# Altium schematic sheet 0.66寸oled.SchDoc
size A4; SheetNumber: 1; SheetTotal: 1
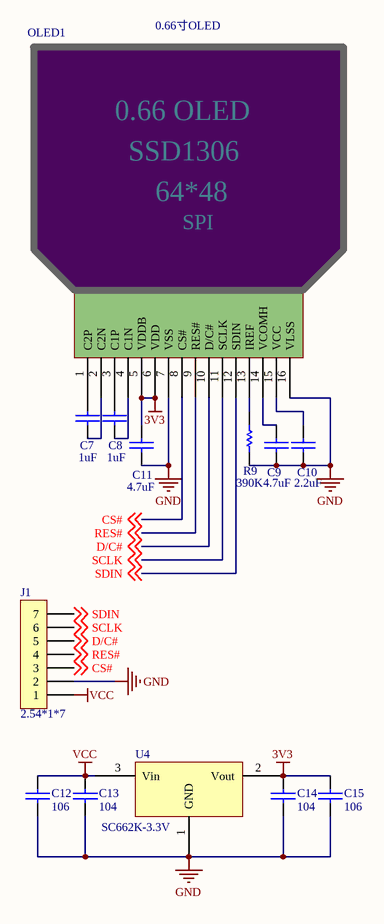
[diagram p0: 0.66寸oled.SchDoc]

## Parts
C7  1uF  [0603-C]
C8  1uF  [0603-C]
C9  4.7uF  [0603-C]
C10  2.2uF  [0603-C]
C11  4.7uF  [0603-C]
C12  106  [0603-C]
C13  104  [0603-C]
C14  104  [0603-C]
C15  106  [0603-C]
J1  2.54*1*7  [Pin HDR1X7/2.54mm-S]
OLED1  0.66寸OLED  [0.66OLED-W]
R9  390K  [0603-R]
U4  SC662K-3.3V  [SOT-23]

## Nets
3V3: C11.2 C14.1 C15.1 OLED1.5(VDDB) OLED1.6(VDD) U4.2(Vout)
GND: C9.1 C10.1 C11.1 C12.2 C13.2 C14.2 C15.2 J1.2 OLED1.7(VSS) OLED1.16(VLSS) R9.2 U4.1(GND)
VCC: C12.1 C13.1 J1.1 U4.3(Vin)
CS#: J1.3 OLED1.8(CS#) ; off-sheet CS#
D/C#: J1.5 OLED1.10(D/C#) ; off-sheet D/C#
RES#: J1.4 OLED1.9(RES#) ; off-sheet RES#
SCLK: J1.6 OLED1.11(SCLK) ; off-sheet SCLK
SDIN: J1.7 OLED1.12(SDIN) ; off-sheet SDIN
NetC7_1: C7.1 OLED1.2(C2N)
NetC7_2: C7.2 OLED1.1(C2P)
NetC8_1: C8.1 OLED1.4(C1N)
NetC8_2: C8.2 OLED1.3(C1P)
NetC9_2: C9.2 OLED1.14(VCOMH)
NetC10_2: C10.2 OLED1.15(VCC)
NetOLED1_13: OLED1.13(IREF) R9.1

## Notes on the sheet
- (in symbol 0.66寸OLED) 0.66 OLED; SSD1306; 64*48; SPI

## Library data of the parts
C7-C15 = CAP: 无极性电容
J1 = Pin HDR1X7
R9 = RES
U4 = AMS1117: 三端稳压芯片